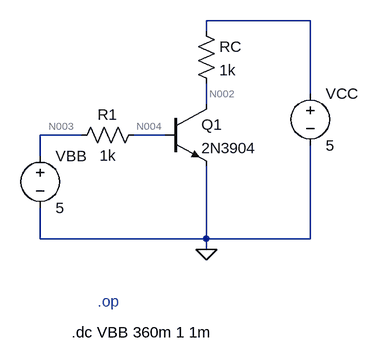
[diagram p0: schematic bjt.asc]
bjt.asc, the LTspice schematic file:
Version 4.1
SHEET 1 880 680
WIRE 384 -64 224 -64
WIRE 224 -48 224 -64
WIRE 384 48 384 -64
WIRE 224 64 224 32
WIRE 32 112 -32 112
WIRE 160 112 112 112
WIRE -32 144 -32 112
WIRE -32 272 -32 224
WIRE 224 272 224 160
WIRE 224 272 -32 272
WIRE 384 272 384 128
WIRE 384 272 224 272
WIRE 224 288 224 272
FLAG 224 288 0
SYMBOL npn 160 64 R0
SYMATTR InstName Q1
SYMATTR Value 2N3904
SYMBOL voltage 384 32 R0
WINDOW 123 0 0 Left 0
WINDOW 39 0 0 Left 0
SYMATTR InstName VCC
SYMATTR Value 5
SYMBOL voltage -32 128 R0
WINDOW 123 0 0 Left 0
WINDOW 39 0 0 Left 0
SYMATTR InstName VBB
SYMATTR Value 5
SYMBOL res 208 -64 R0
SYMATTR InstName RC
SYMATTR Value 1k
SYMBOL res 128 96 R90
WINDOW 0 0 56 VBottom 2
WINDOW 3 32 56 VTop 2
SYMATTR InstName R1
SYMATTR Value 1k
TEXT 56 368 Left 2 ;.op
TEXT 16 416 Left 2 !.dc VBB 360m 1 1m

The netlist it stands for:
* bjt.asc
Q1 N002 N004 0 0 2N3904
VCC N001 0 5
VBB N003 0 5
RC N001 N002 1k
R1 N004 N003 1k
.model NPN NPN
.model PNP PNP
.lib standard.bjt
* .op
.dc VBB 360m 1 1m
.backanno
.end

* Results of the author's LTspice run, read from the files saved beside the schematic
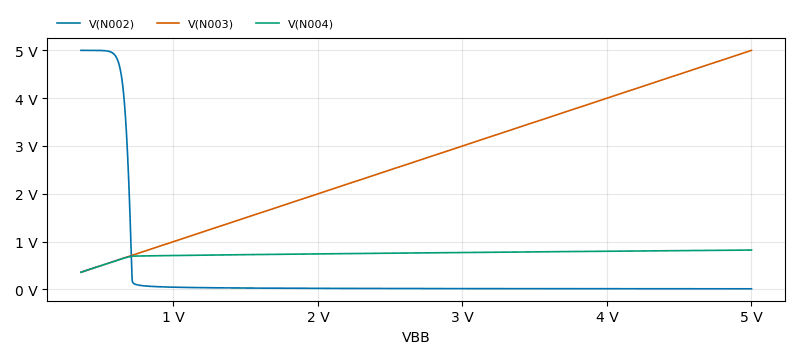
[diagram p1: DC transfer characteristic of bjt.asc, plotted from the saved traces]
* DC transfer characteristic, 1 run:
*   V(N002): 5 V at VBB=360 mV, 13.46 mV at VBB=5 V, min 13.46 mV, max 5 V
*   V(N003): 360 mV at VBB=360 mV, 5 V at VBB=5 V, min 360 mV, max 5 V
*   V(N004): 360 mV at VBB=360 mV, 823.9 mV at VBB=5 V, min 360 mV, max 823.9 mV